# Altium schematic sheet USB.SchDoc: Iris
size A3; Organization: Toradex AG; Address1: Altsagenstrasse 5; Address2: Horw; Address3: 6048; Address4: Switzerland; DocumentNumber: 6; Revision: V2.0; SheetNumber: 6; SheetTotal: 16
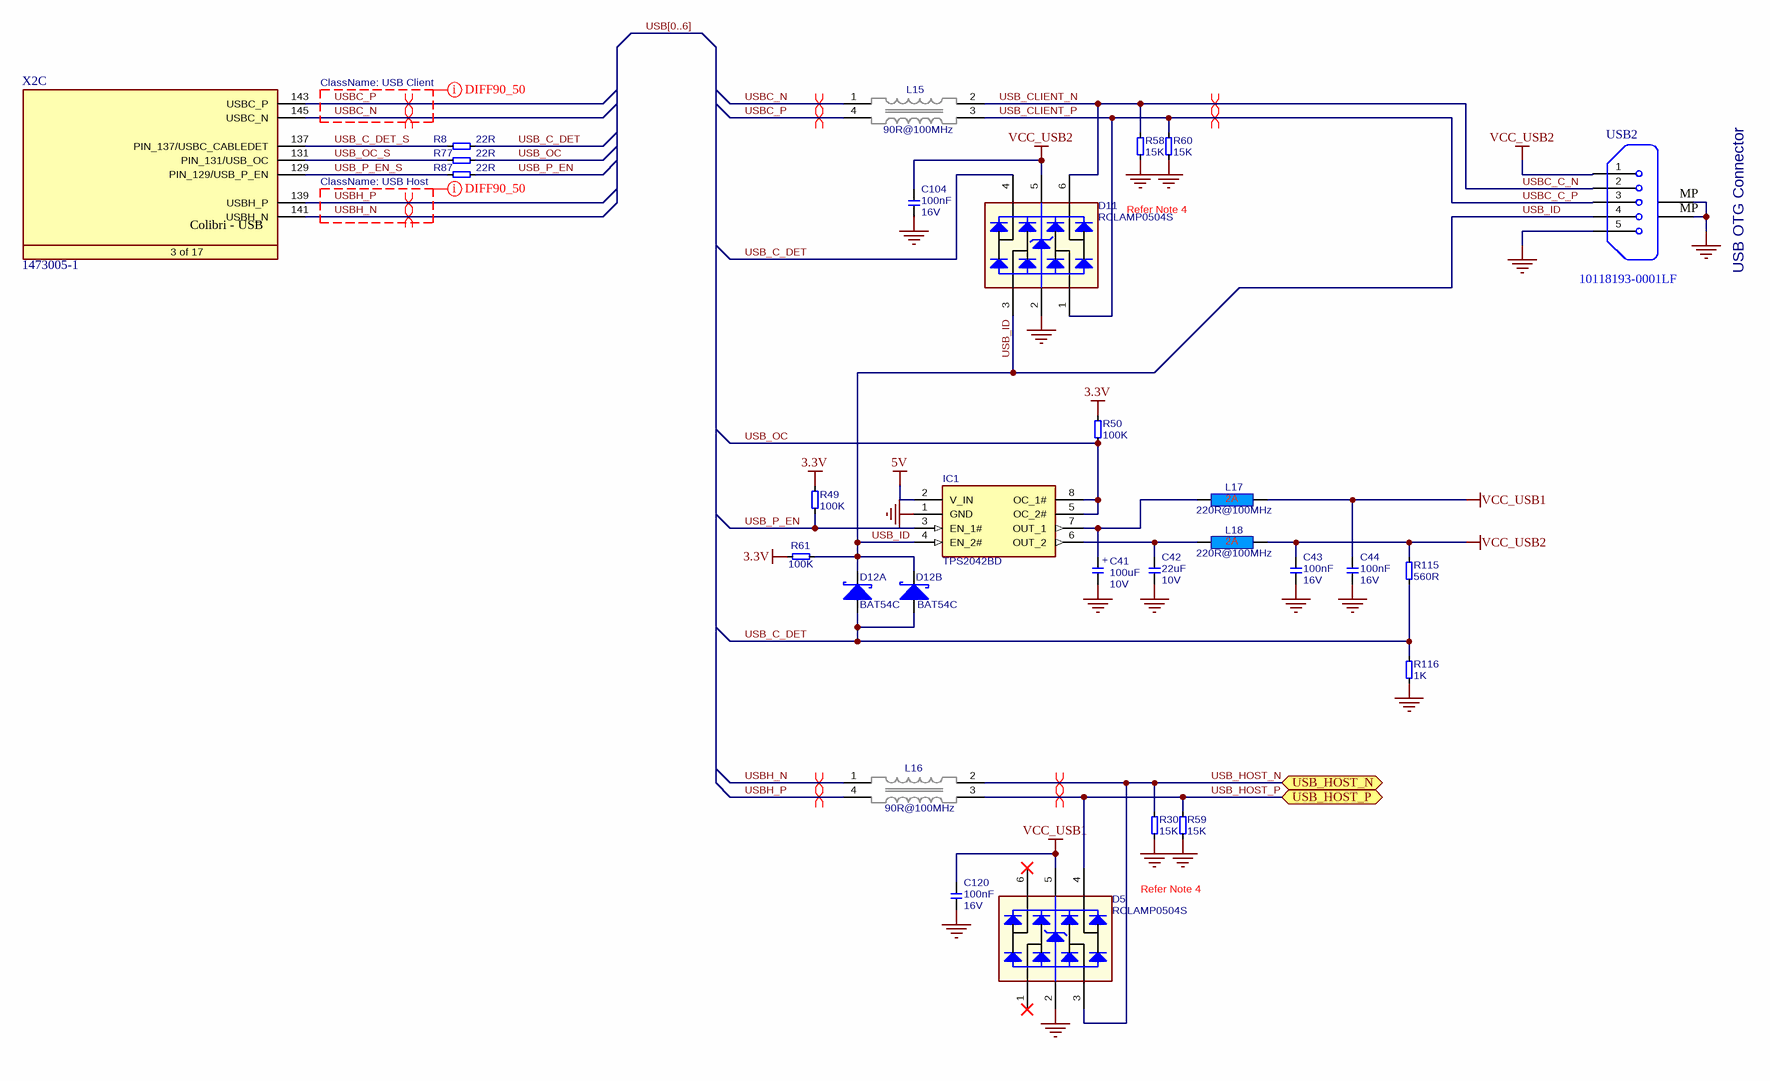
[diagram p0: USB.SchDoc]

## Parts
C41  Rating: 10V  [CAPMP3528X210N]  (hidden comment: 100uF)
C42  Rating: 10V  [T_CAPC0805X125N]  (hidden comment: 22uF)
C43  Rating: 16V  [CAPC1005X60N]  (hidden comment: 100nF)
C44  Rating: 16V  [CAPC1005X60N]  (hidden comment: 100nF)
C104  Rating: 16V  [CAPC1005X60N]  (hidden comment: 100nF)
C120  Rating: 16V  [CAPC1005X60N]  (hidden comment: 100nF)
D5  RCLAMP0504S  [T_SOT95P285X90-6N]
D11  RCLAMP0504S  [T_SOT95P285X90-6N]
D12  BAT54C  [SOT95P230X110-3N]  (parts A,B of 2)
IC1  TPS2042BD  [SOIC127P600X173-8N]
L15  90R@100MHz  [T_Murata_DLW21SN900SQ2]
L16  90R@100MHz  [T_Murata_DLW21SN900SQ2]
L17  220R@100MHz  [INDC1608X95N]
L18  220R@100MHz  [INDC1608X95N]
R8  22R  [RESC1005X40N]
R30  15K  [T_RESC0603X30N]
R49  100K  [RESC1005X40N]
R50  100K  [RESC1005X40N]
R58  15K  [T_RESC0603X30N]
R59  15K  [T_RESC0603X30N]
R60  15K  [T_RESC0603X30N]
R61  100K  [RESC1005X40N]
R77  22R  [RESC1005X40N]
R87  22R  [RESC1005X40N]
R115  560R  [RESC1005X40N]
R116  1K  [RESC1005X40N]
USB2  10118193-0001LF  [10118193-0001LF]
X2  1473005-1  [T_Tyco_1473005-1]  (part C of 17)

## Ports
USB_HOST_N (bidir), USB_HOST_P (bidir)

## Nets
3.3V: R49.2 R50.2 R61.2
5V: IC1.2(V_IN)
GND: C41.2 C42.1 C43.1 C44.1 C104.1 C120.1 D5.2 D11.2 IC1.1(GND) R30.1 R58.1 R59.1 R60.1 R116.2 USB2.5 USB2.6
VCC_USB1: C44.2 C120.2 D5.5 L17.2
VCC_USB2: C43.2 C104.2 D11.5 L18.2 R115.1 USB2.1
USB_C_DET: D11.4 D12.1 D12.2 R8.2 R115.2 R116.1
USB_C_DET_S: R8.1 X2.137(PIN_137/USBC_CABLEDET)
USB_CLIENT_N: D11.6 L15.2 R58.2 USB2.2  [also labelled USBC_C_N]
USB_CLIENT_P: D11.1 L15.3 R60.2 USB2.3  [also labelled USBC_C_P]
USB_HOST_N: D5.3 L16.2 R30.2 ; port USB_HOST_N
USB_HOST_P: D5.4 L16.3 R59.2 ; port USB_HOST_P
USB_ID: D11.3 D12.3 IC1.4(EN_2#) R61.1 USB2.4
USB_OC: IC1.5(OC_2#) IC1.8(OC_1#) R50.1 R77.2
USB_OC_S: R77.1 X2.131(PIN_131/USB_OC)
USB_P_EN: IC1.3(EN_1#) R49.1 R87.2
USB_P_EN_S: R87.1 X2.129(PIN_129/USB_P_EN)
USBC_N: L15.1 X2.145(USBC_N)
USBC_P: L15.4 X2.143(USBC_P)
USBH_N: L16.1 X2.141(USBH_N)
USBH_P: L16.4 X2.139(USBH_P)
NetC41_1: C41.1 IC1.7(OUT_1) L17.1
NetC42_2: C42.2 IC1.6(OUT_2) L18.1

Not connected (* = marked no-connect by the designer): D5 1* 6*

## Buses and harness runs
bus USB[0..6]

## Layout directives
differential pair: USB_CLIENT_N, USB_CLIENT_P, USB_HOST_N, USB_HOST_P, USBC_N, USBC_P, USBH_N, USBH_P
net class USB Client: USBC_N, USBC_P
net class USB Host: USBH_N, USBH_P

## Notes on the sheet
- Refer Note 4
- USB OTG Connector
- Title
- Size:
- Date:
- A3
- Number:
- Time:
- Revision:
- Sheet
- of
- File:
- (in symbol C-TA-100uF-10V-20%-3528) +
- (in symbol CON-Tyco-1473005-1-200-0.6mm, part C) Colibri - USB; 3 of 17
- (in symbol USB Micro-B) MP

## Library data of the parts
C41 = C-TA-100uF-10V-20%-3528: Capacitor TA 100uF 10V 20% 3528; Tolerance: 20%; Type: TA; Value: 100uF
C42 = C-X5R-22uF-10V-20%-0805: Capacitor Ceramic X5R 22uF 10V 20% 0805; Tolerance: 20%; Type: X5R; Value: 22uF
C43 C44 C104 C120 = C-X7R-100nF-16V-10%-0402: Capacitor Ceramic X7R 100nF 16V 10% 0402; Tolerance: 10%; Type: X7R; Value: 100nF
D5 D11 = D-Semtech-RClamp0504S: TVS Array low cap; Manufacturer Name: Semtech; Manufacturer Part No.: RCLAMP0504S
D12 = D-Philips-BAT54C-Schottky: BAT54C Schottky Diode; Manufacturer Name: Philips; Manufacturer Part No.: BAT54C
IC1 = IC-TI-TPS2042BD: Dual High Side Switch With OC_DET 500mA/CH; Manufacturer Name: Texas Instruments; Manufacturer Part No.: TPS2042BD
L15 L16 = L-Murata-DLW21SN900SQ2-90R@100MHz-330mA-25%: Common Mode Choke High Speed 90R 330mA; Manufacturer Name: Murata; Tolerance: 25%; Rating: 330mA; Manufacturer Part No.: DLW21SN900SQ2; Value: 90R@100MHz
L17 L18 = L-220R@100MHz-2A-25%-0603: 220R@100MHz 2A EMI FILTER; Tolerance: 25%; Rating: 2A; Value: 220R@100MHz
R8 R77 R87 = R-22R-63mW-5%-0402: Resistor 22 ohm 63mW 5% 0402; Rating: 63mW; Tolerance: 5%; Value: 22R
R30 R58-R60 = R-15KR-63mW-5%-0603: Resistor 15 Kohm 63mW 5% 0603; Value: 15KR; Rating: 63mW; Tolerance: 5%
R49 R50 R61 = R-100KR-63mW-5%-0402: Resistor 100 Kohm 63mW 5% 0402; Value: 100KR; Rating: 63mW; Tolerance: 5%
R115 = R-560R-63mW-5%-0402: Resistor 560 ohm 63mW 5% 0402; Rating: 63mW; Tolerance: 5%; Value: 560R
R116 = R-1KR-63mW-5%-0402: Resistor 1 Kohm 63mW 5% 0402; Rating: 63mW; Tolerance: 5%; Value: 1K
USB2 = USB Micro-B: Value: Micro USB Type B; E14 pn: 2751675; mpn: 10118193-0001LF
X2 = CON-Tyco-1473005-1-200-0.6mm: SODIMM Connector; Manufacturer Name: Tyco; No. of ways: 200; Manufacturer Part No.: 1473005-1